# EAGLE schematic jnode_v32 (EAGLE 6.5.0)
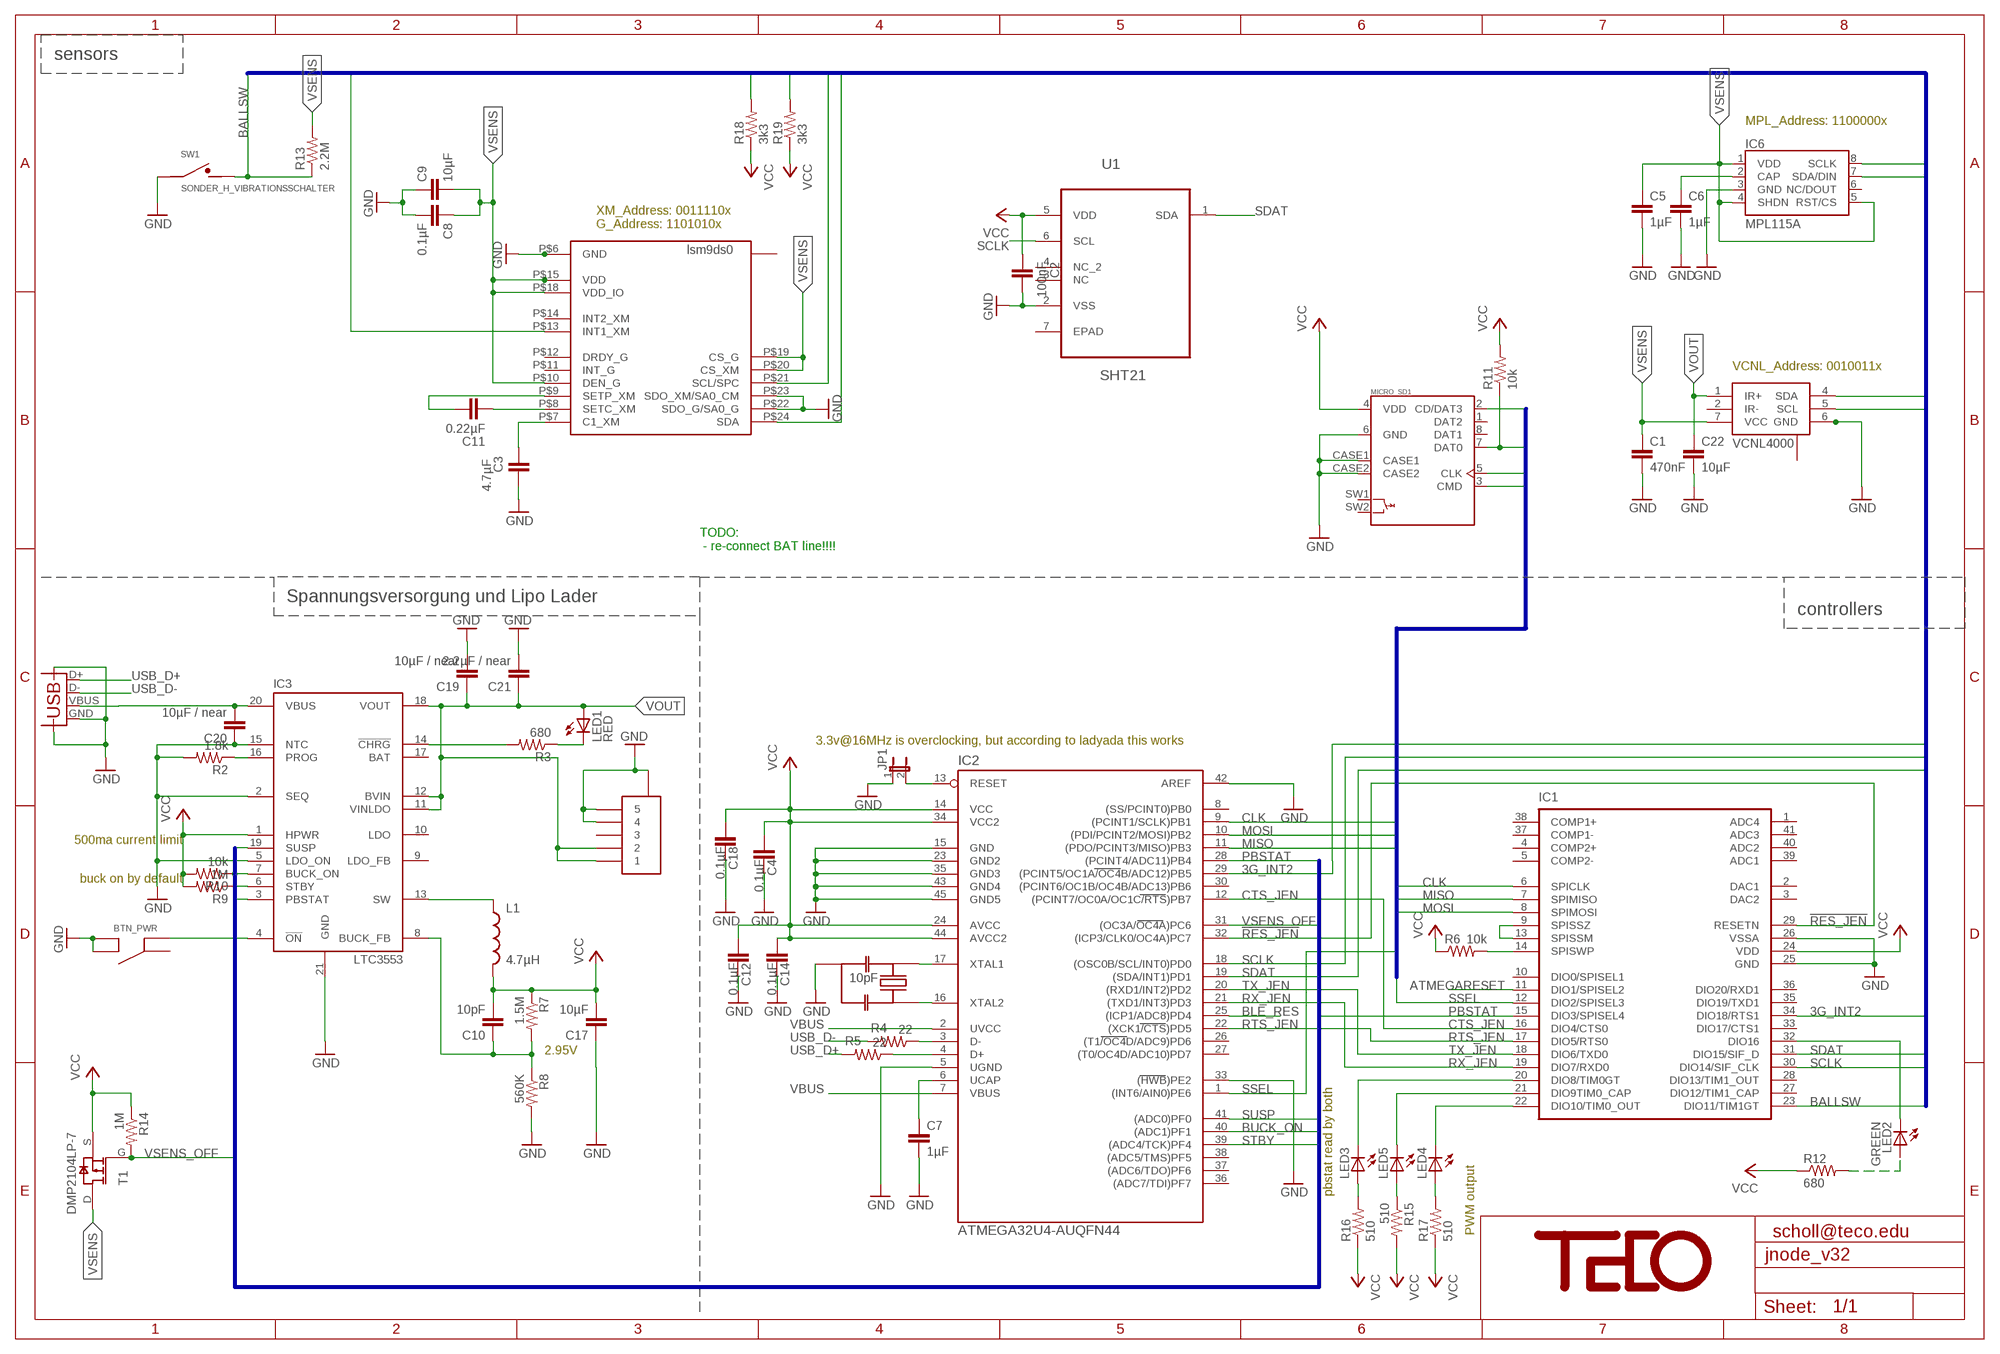
[diagram p0: schematic, sheet 1]

## Parts
BTN_PWR  TACTILE_SWITCH  [EVQ-PUK02K]
C1  470nF  CAP0402-CAP  [0402-CAP]
C2  100nF  CAP0402-CAP  [0402-CAP]
C3  4.7µF  CAP0402-CAP  [0402-CAP]
C4  0.1µF  CAP0402-CAP  [0402-CAP]
C5  1µF  CAP0402-CAP  [0402-CAP]
C6  1µF  CAP0402-CAP  [0402-CAP]
C7  1µF  CAP0402-CAP  [0402-CAP]
C8  0.1µF  CAP0402-CAP  [0402-CAP]
C9  10µF  CAP0603-CAP  [0603-CAP]
C10  10pF  CAP0402-CAP  [0402-CAP]
C11  0.22µF  CAP0402-CAP  [0402-CAP]
C12  0.1µF  CAP0402-CAP  [0402-CAP]
C14  0.1µF  CAP0402-CAP  [0402-CAP]
C17  10µF  CAP0603-CAP  [0603-CAP]
C18  0.1µF  CAP0402-CAP  [0402-CAP]
C19  10µF / near  CAP0603-CAP  [0603-CAP]
C20  10µF / near  CAP0603-CAP  [0603-CAP]
C21  2.2µF / near  CAP0402-CAP  [0402-CAP]
C22  10µF  CAP0603-CAP  [0603-CAP]
IC1  JENNIC_JN51XXSMDTH  [JN5148_SMDTH]
IC2  ATMEGA32U4-AUQFN44  [QFN44]
IC3  LTC3553  [QFN20]
IC6  MPL115A  [LGA8]
JP1  JUMPER-2SMD-NO  [SJ_2S-NO]
L1  4.7µH  SPARKFUN_INDUCTOR  [MLP2012]
LED1  RED  LEDCHIP-LED0402  [CHIP-LED0402]
LED2  GREEN  LEDCHIP-LED0402  [CHIP-LED0402]
LED3  LEDGL100MD1MP1  [GL100MD1MP1]
LED4  LEDGL100MD1MP1  [GL100MD1MP1]
LED5  LEDGL100MD1MP1  [GL100MD1MP1]
MICRO_SD1  SENSOR_BOARD_MOLEX_47309-2651'NEW'  [SENSOR_BOARD_MOLEX_47309-2651]
R2  1.8k  RESISTOR0402-RES  [0402-RES]
R3  680  RESISTOR0402-RES  [0402-RES]
R4  22  RESISTOR0402-RES  [0402-RES]
R5  22  RESISTOR0402-RES  [0402-RES]
R6  10k  RESISTOR0402-RES  [0402-RES]
R7  1.5M  RESISTOR0402-RES  [0402-RES]
R8  560K  RESISTOR0402-RES  [0402-RES]
R9  1M  RESISTOR0402-RES  [0402-RES]
R10  10k  RESISTOR0402-RES  [0402-RES]
R11  10k  RESISTOR0402-RES  [0402-RES]
R12  680  RESISTOR0402-RES  [0402-RES]
R13  2.2M  RESISTOR0402-RES  [0402-RES]
R14  1M  RESISTOR0402-RES  [0402-RES]
R15  510  RESISTOR0402-RES  [0402-RES]
R16  510  RESISTOR0402-RES  [0402-RES]
R17  510  RESISTOR0402-RES  [0402-RES]
R18  3k3  RESISTOR0402-RES  [0402-RES]
R19  3k3  RESISTOR0402-RES  [0402-RES]
SW1  SONDER_H_VIBRATIONSSCHALTER  [SONDER_H_VIBSCHALTER]
T1  DMP2104LP-7  [DFN1411-3]
U1  SHT21  [DFN300X300X110-7N]
U$1  SFV5R  [SFV5R]
U$2  LSM9D  [LGA4X4]
U$6  RESONATORPRQC-S  [PRQC]
U$9  TECO-LOGO  [TECO-LOGO]
VCNL4000  VCNL4000  [VNCL4000]
X1  USBMICROB-XT  [USB-MICROB-XT]

## Nets
3G_INT2: IC1.34(DIO18/RTS1) IC2.29((PCINT5/OC1A/OC4B/ADC12)PB5) U$2.P$13(INT1_XM)
!RES_JEN: IC1.29(RESETN) IC2.32((ICP3/CLK0/OC4A)PC7)
ATMEGARESET: IC1.11(DIO1/SPISEL2) IC2.13(RESET) JP1.2
BALLSW: IC1.23(DIO11/TIM1GT) R13.1 SW1.2
BLE_RES: IC2.25((ICP1/ADC8)PD4)
BUCK_FB: C10.1 IC3.8(BUCK_FB) R7.2 R8.1
BUCK_ON: IC2.40((ADC1)PF1) IC3.7(BUCK_ON) R10.1
CLK: IC1.6(SPICLK) IC2.9((PCINT1/SCLK)PB1) MICRO_SD1.5(CLK)
CTS_JEN: IC1.16(DIO4/CTS0) IC2.12((PCINT7/OC0A/OC1C/RTS)PB7)
GND: BTN_PWR.2(B) BTN_PWR.4(B) C1.2 C2.1 C3.2 C4.1 C5.2 C6.2 C7.2 C8.2 C9.1 C12.1 C14.1 C17.1 C18.1 C19.2 C20.1 C21.2 C22.2 IC1.25(GND) IC1.26(VSSA) IC2.5(UGND) IC2.15(GND) IC2.23(GND2) IC2.33((HWB)PE2) IC2.35(GND3) IC2.42(AREF) IC2.43(GND4) IC2.45(GND5) IC3.2(SEQ) IC3.5(LDO_ON) IC3.15(NTC) IC3.21(GND) IC6.3(GND) JP1.1 MICRO_SD1.6(GND) MICRO_SD1.CASE1 MICRO_SD1.CASE2 R2.2 R8.2 SW1.1 U1.2(VSS) U$1.P$4 U$1.P$5 U$1.P$6 U$1.P$7 U$2.P$5(GND) U$2.P$6(GND) U$2.P$22(SDO_G/SA0_G) U$2.P$23(SDO_XM/SA0_CM) U$6.GND VCNL4000.6(GND) VCNL4000.12(GND) X1.GND X1.GND@2(CASE) X1.GND@3(CASE)
LEDRED: IC1.32(DIO16) LED2.P$2(C)
MISO: IC1.7(SPIMISO) IC2.11((PDO/PCINT3/MISO)PB3) MICRO_SD1.7(DAT0) R11.1
MOSI: IC1.8(SPIMOSI) IC2.10((PDI/PCINT2/MOSI)PB2) MICRO_SD1.3(CMD)
N$1: IC2.3(D-) R4.1
N$2: C3.1 U$2.P$7(C1_XM)
N$3: IC2.4(D+) R5.1
N$4: C7.1 IC2.6(UCAP)
N$5: IC3.16(PROG) R2.1
N$6: VCNL4000.2(IR-) VCNL4000.3(IR-)
N$7: C11.2 U$2.P$8(SETC_XM)
N$8: C11.1 U$2.P$9(SETP_XM)
N$9: BTN_PWR.3(A) IC3.4(!ON)
N$10: C6.1 IC6.2(CAP)
N$11: LED1.P$2(C) R3.1
N$12: IC3.14(!CHRG) R3.2
N$13: IC1.9(SPISSZ) IC1.13(SPISSM)
N$14: IC1.14(SPISWP) R6.2
N$16: IC2.17(XTAL1) U$6.2
N$17: IC2.16(XTAL2) U$6.1
N$29: LED2.P$1(A) R12.2
N$30: IC1.21(DIO9TIM0_CAP) LED5.2(C)
N$31: IC1.20(DIO8/TIM0GT) LED3.2(C)
N$32: LED3.1(A) R16.2
N$33: LED5.1(A) R15.1
N$34: IC1.22(DIO10/TIM0_OUT) LED4.2(C)
N$35: LED4.1(A) R17.2
PBSTAT: IC1.15(DIO3/SPISEL4) IC2.28((PCINT4/ADC11)PB4) IC3.3(PBSTAT)
RTS_JEN: IC1.17(DIO5/RTS0) IC2.22((XCK1/CTS)PD5)
RX_JEN: IC1.19(DIO7/RXD0) IC2.21((TXD1/INT3)PD3)
SCLK: IC1.30(DIO14/SIF_CLK) IC2.18((OSC0B/SCL/INT0)PD0) IC6.8(SCLK) R19.2 U1.6(SCL) U$2.P$21(SCL/SPC) VCNL4000.5(SCL)
SDAT: IC1.31(DIO15/SIF_D) IC2.19((SDA/INT1)PD1) IC6.7(SDA/DIN) R18.2 U1.1(SDA) U$2.P$24(SDA) VCNL4000.4(SDA)
SSEL: IC1.12(DIO2/SPISEL3) IC2.1((INT6/AIN0)PE6) MICRO_SD1.2(CD/DAT3)
STBY: IC2.39((ADC4/TCK)PF4) IC3.6(STBY) R9.1
SUSP: IC2.41((ADC0)PF0) IC3.19(SUSP)
SW: IC3.13(SW) L1.P$1
TX_JEN: IC1.18(DIO6/TXD0) IC2.20((RXD1/INT2)PD2)
USB_D+: R5.2 X1.D+
USB_D-: R4.2 X1.D-
VBUS: C20.2 IC2.2(UVCC) IC2.7(VBUS) IC3.20(VBUS) X1.VBUS
VCC: C2.2 C4.2 C10.2 C12.2 C14.2 C17.2 C18.2 IC1.24(VDD) IC2.14(VCC) IC2.24(AVCC) IC2.34(VCC2) IC2.44(AVCC2) IC3.1(HPWR) L1.P$2 MICRO_SD1.4(VDD) R6.1 R7.1 R9.2 R10.2 R11.2 R12.1 R14.1 R15.2 R16.1 R17.1 R18.1 R19.1 T1.S U1.5(VDD)
VOUT: C19.1 C21.1 C22.1 IC3.11(VINLDO) IC3.12(BVIN) IC3.18(VOUT) LED1.P$1(A) U$1.P$1 U$1.P$2 VCNL4000.1(IR+)
VSENS: C1.1 C5.1 C8.1 C9.2 IC6.1(VDD) IC6.4(SHDN) IC6.5(RST/CS) R13.2 T1.D U$2.P$10(DEN_G) U$2.P$15(VDD) U$2.P$16(VDD) U$2.P$17(VDD) U$2.P$18(VDD_IO) U$2.P$19(CS_G) U$2.P$20(CS_XM) VCNL4000.7(VCC)
VSENS_OFF: IC2.31((OC3A/OC4A)PC6) R14.2 T1.G
Unconnected: BTN_PWR.1(A) IC1.1(ADC4) IC1.2(DAC1) IC1.3(DAC2) IC1.4(COMP2+) IC1.5(COMP2-) IC1.10(DIO0/SPISEL1) IC1.27(DIO12/TIM1_CAP) IC1.28(DIO13/TIM1_OUT) IC1.33(DIO17/CTS1) IC1.35(DIO19/TXD1) IC1.36(DIO20/RXD1) IC1.37(COMP1-) IC1.38(COMP1+) IC1.39(ADC1) IC1.40(ADC2) IC1.41(ADC3) IC2.8((SS/PCINT0)PB0) IC2.26((T1/OC4D/ADC9)PD6) IC2.27((T0/OC4D/ADC10)PD7) IC2.30((PCINT6/OC1B/OC4B/ADC13)PB6) IC2.36((ADC7/TDI)PF7) IC2.37((ADC6/TDO)PF6) IC2.38((ADC5/TMS)PF5) IC3.9(LDO_FB) IC3.10(LDO) IC3.17(BAT) IC6.6(NC/DOUT) MICRO_SD1.1(DAT2) MICRO_SD1.8(DAT1) MICRO_SD1.SW1 MICRO_SD1.SW2 U1.3(NC) U1.4(NC_2) U1.7(EPAD) U$1.P$3 U$2.P$1(RES) U$2.P$2(RES) U$2.P$3(RES) U$2.P$4(RES) U$2.P$11(INT_G) U$2.P$12(DRDY_G) U$2.P$14(INT2_XM) VCNL4000.8(NC) VCNL4000.9(NC) VCNL4000.10(NC) VCNL4000.11(NC)

## Buses
PWRCTRL:BUCK_ON,STBY,PBSTAT,SUSP,VSENS_OFF
SPI:SSEL,MISO,MOSI,CLK
I2C:SCLK,SDAT,BALLSW,3G_INT2

## Notes on the sheet
- sensors
- MPL_Address: 1100000x
- XM_Address: 0011110x
  G_Address: 1101010x
- VCNL_Address: 0010011x
- TODO:
   - re-connect BAT line!!!!
- Spannungsversorgung und Lipo Lader
- controllers
- 3.3v@16MHz is overclocking, but according to ladyada this works
- 500ma current limit
- buck on by default
- 10pF
- 2.95V
- pbstat read by both
- PWM output | scholl@teco.edu

## Library data of the parts
BTN_PWR = jnode:TACTILE_SWITCH: collection of tactile switches; DIGIKEY: http://search.digikey.com/scripts/DkSearch/dksus.dll?Detail&name=P10852SCT-ND
C1 = sparkfun:CAP: Capacitor Standard 0603 ceramic capacitor, and 0.1" leaded capacitor.; DIGIKEY: http://www.digikey.com/product-detail/en/JMK105BJ474KV-F/587-1230-1-ND/931007
C2 = sparkfun:CAP: Capacitor Standard 0603 ceramic capacitor, and 0.1" leaded capacitor.; DIGIKEY: http://www.digikey.com/product-detail/en/C1005X5R0J104K050BA/445-1266-1-ND/567731
C3 = sparkfun:CAP: Capacitor Standard 0603 ceramic capacitor, and 0.1" leaded capacitor.; DIGIKEY: http://www.digikey.com/product-detail/en/CL05A475MQ5NRNC/1276-1056-1-ND/3889142
C4 C18 = sparkfun:CAP: Capacitor Standard 0603 ceramic capacitor, and 0.1" leaded capacitor.; DIGIKEY: http://search.digikey.com/scripts/DkSearch/dksus.dll?Detail&name=490-1318-1-ND; FARNELL: http://de.farnell.com/multicomp/mcca000051/mlcc-04025v-16v-100nf/dp/1758897; PLACE: no; TECO: yes
C5 C6 = sparkfun:CAP: Capacitor Standard 0603 ceramic capacitor, and 0.1" leaded capacitor.; DIGIKEY: http://search.digikey.com/scripts/DkSearch/dksus.dll?Detail&name=490-1320-1-ND; FARNELL: http://de.farnell.com/multicomp/mcca000500/mlcc-0402-x5r-6-3v-1uf/dp/1759375
C7 = sparkfun:CAP: Capacitor Standard 0603 ceramic capacitor, and 0.1" leaded capacitor.; DIGIKEY: http://search.digikey.com/scripts/DkSearch/dksus.dll?Detail&name=490-1320-1-ND; FARNELL: http://de.farnell.com/multicomp/mcca000500/mlcc-0402-x5r-6-3v-1uf/dp/1759375; TECO: yes
C8 C12 C14 = sparkfun:CAP: Capacitor Standard 0603 ceramic capacitor, and 0.1" leaded capacitor.; DIGIKEY: http://search.digikey.com/scripts/DkSearch/dksus.dll?Detail&name=490-1318-1-ND; FARNELL: http://de.farnell.com/multicomp/mcca000051/mlcc-04025v-16v-100nf/dp/1758897; TECO: yes
C9 = sparkfun:CAP: Capacitor Standard 0603 ceramic capacitor, and 0.1" leaded capacitor.; DIGIKEY: http://search.digikey.com/scripts/DkSearch/dksus.dll?Detail&name=445-7454-1-ND
C10 = sparkfun:CAP: Capacitor Standard 0603 ceramic capacitor, and 0.1" leaded capacitor.; DIGIKEY: http://search.digikey.com/scripts/DkSearch/dksus.dll?Detail&name=311-1014-1-ND; FARNELL: http://de.farnell.com/multicomp/mcca000091/mlcc-0402-np0-50v-10pf/dp/1758941; TECO: yes
C11 = sparkfun:CAP: Capacitor Standard 0603 ceramic capacitor, and 0.1" leaded capacitor.; DIGIKEY: http://www.digikey.com/product-detail/en/C0402C224K9PACTU/399-4886-1-ND/1090881
C17 C22 = sparkfun:CAP: Capacitor Standard 0603 ceramic capacitor, and 0.1" leaded capacitor.; DIGIKEY: http://www.digikey.com/product-detail/en/C1608X6S0G106K080AB/445-7454-1-ND/2733526
C19 C20 = sparkfun:CAP: Capacitor Standard 0603 ceramic capacitor, and 0.1" leaded capacitor.; DIGIKEY: http://search.digikey.com/scripts/DkSearch/dksus.dll?Detail&name=445-7454-1-ND; FARNELL: http://de.farnell.com/multicomp/mcca000517/mlcc-0603-x5r-6-3v-10uf/dp/1759393; TECO: yes
C21 = sparkfun:CAP: Capacitor Standard 0603 ceramic capacitor, and 0.1" leaded capacitor.; DIGIKEY: http://search.digikey.com/scripts/DkSearch/dksus.dll?Detail&name=445-7396-1-ND; FARNELL: http://de.farnell.com/multicomp/mcca000501/mlcc-0402-x5r-6-3v-2-2uf/dp/1759376RL; TECO: yes
IC1 = jnode:JENNIC_JN51XX: JN5139-xxx-M00xxx, Farnell: 1500175; DIGIKEY: http://search.digikey.com/de/de/products/JN5148%2F001M00T,534/616-1045-1-ND/2139684; FUTUREELECTRIC: http://de.futureelectronics.com/de/technologies/semiconductors/microcontrollers/32-bit/Seiten/6004977-JN5148-001M00T,534.aspx; PLACE: NO; TECO: yes
IC2 = jnode:ATMEGA32U4-AU; DIGIKEY: http://search.digikey.com/scripts/DkSearch/dksus.dll?Detail&name=ATMEGA32U4-MU-ND
IC3 = jnode:LTC3553; DIGIKEY: http://search.digikey.com/scripts/DkSearch/dksus.dll?Detail&name=LTC3553EUD%23PBF-ND
IC6 = mpl115:MPL115A: MPL115A1 (SPI) and MPL115A2 (I2C) Miniature Digital Barometer 5.0x3.0x1.2mm LGA Package; DIGIKEY: http://search.digikey.com/scripts/DkSearch/dksus.dll?Detail&name=MPL115A2T1CT-ND; TECO: yes
JP1 = sparkfun:JUMPER-2: Jumper Basic 0.1" spaced jumper. Use with breakaway headers.
L1 = jnode:SPARKFUN_INDUCTOR: Inductors Basic Inductor/Choke - 0603 and 1206. Footprints are not proven and vary greatly between part numbers.; DIGIKEY: http://search.digikey.com/scripts/DkSearch/dksus.dll?Detail&name=445-6366-1-ND; FARNELL: http://de.farnell.com/tdk/mlp2012s4r7mt/vielschicht-induktivitaet-4-7uh/dp/2345132?Ntt=MLP2012S4R7M
LED1 LED2 = jnode:LED: LED OSRAM: - CHIPLED LG R971, LG N971, LY N971, LG Q971, LY Q971, LO R971, LY R971 LH N974, LH R974 LS Q976, LO Q976, LY Q976 LO Q996 - Hyper CHIPLED LW Q18S LB Q993, LB Q99A, LB R99A - SideLED LS A670, LO A670, LY A670, LG A670, LP A670 LB A673, LV A673, LT A673, LW A673 LH A674 LY A675 LS A676, LA A676, LO A676, LY A676, LW A676 LS A679, LY A679, LG A679 - Hyper Micro SIDELED� LS Y876, LA Y876, LO Y876, LY Y876 LT Y87S - SmartLED LW L88C, LW L88S LB L89C, LB L89S, LG L890 LS L89K, LO L89K, LY L89K LS L896, LA L896, LO L896, LY L896 - TOPLED LS T670, LO T670, LY T670, LG T670, LP T670 LSG T670, LSP T670, LSY T670, LOP T670, LYG T670 LG T671, LOG T671, LSG T671 LB T673, LV T673, LT T673, LW T673 LH T674 LS T676, LA T676, LO T676, LY T676, LB T676, LH T676, LSB T676, LW T676 LB T67C, LV T67C, LT T67C, LS T67K, LO T67K, LY T67K, LW E67C LS E67B, LA E67B, LO E67B, LY E67B, LB E67C, LV E67C, LT E67C LW T67C LS T679, LY T679, LG T679 LS T770, LO T770, LY T770, LG T770, LP T770 LB T773, LV T773, LT T773, LW T773 LH T774 LS E675, LA E675, LY E675, LS T675 LS T776, LA T776, LO T776, LY T776, LB T776 LHGB T686 LT T68C, LB T68C - Hyper Mini TOPLED� LB M676 - Mini TOPLED Santana� LG M470 LS M47K, LO M47K, LY M47K Source: http://www.osram.convergy.de LUXEON: - LUMILED� LXK2-PW12-R00, LXK2-PW12-S00, LXK2-PW14-U00, LXK2-PW14-V00 LXK2-PM12-R00, LXK2-PM12-S00, LXK2-PM14-U00 LXK2-PE12-Q00, LXK2-PE12-R00, LXK2-PE12-S00, LXK2-PE14-T00, LXK2-PE14-U00 LXK2-PB12-K00, LXK2-PB12-L00, LXK2-PB12-M00, LXK2-PB14-N00, LXK2-PB14-P00, LXK2-PB14-Q00 LXK2-PR12-L00, LXK2-PR12-M00, LXK2-PR14-Q00, LXK2-PR14-R00 LXK2-PD12-Q00, LXK2-PD12-R00, LXK2-PD12-S00 LXK2-PH12-R00, LXK2-PH12-S00 LXK2-PL12-P00, LXK2-PL12-Q00, LXK2-PL12-R00 Source: www.luxeon.com KINGBRIGHT: KA-3528ASYC Source: www.kingbright.com; DIGIKEY: http://search.digikey.com/scripts/DkSearch/dksus.dll?Detail&name=754-1128-1-ND; TECO: yes
LED3-LED5 = jnode:LED: LED OSRAM: - CHIPLED LG R971, LG N971, LY N971, LG Q971, LY Q971, LO R971, LY R971 LH N974, LH R974 LS Q976, LO Q976, LY Q976 LO Q996 - Hyper CHIPLED LW Q18S LB Q993, LB Q99A, LB R99A - SideLED LS A670, LO A670, LY A670, LG A670, LP A670 LB A673, LV A673, LT A673, LW A673 LH A674 LY A675 LS A676, LA A676, LO A676, LY A676, LW A676 LS A679, LY A679, LG A679 - Hyper Micro SIDELED� LS Y876, LA Y876, LO Y876, LY Y876 LT Y87S - SmartLED LW L88C, LW L88S LB L89C, LB L89S, LG L890 LS L89K, LO L89K, LY L89K LS L896, LA L896, LO L896, LY L896 - TOPLED LS T670, LO T670, LY T670, LG T670, LP T670 LSG T670, LSP T670, LSY T670, LOP T670, LYG T670 LG T671, LOG T671, LSG T671 LB T673, LV T673, LT T673, LW T673 LH T674 LS T676, LA T676, LO T676, LY T676, LB T676, LH T676, LSB T676, LW T676 LB T67C, LV T67C, LT T67C, LS T67K, LO T67K, LY T67K, LW E67C LS E67B, LA E67B, LO E67B, LY E67B, LB E67C, LV E67C, LT E67C LW T67C LS T679, LY T679, LG T679 LS T770, LO T770, LY T770, LG T770, LP T770 LB T773, LV T773, LT T773, LW T773 LH T774 LS E675, LA E675, LY E675, LS T675 LS T776, LA T776, LO T776, LY T776, LB T776 LHGB T686 LT T68C, LB T68C - Hyper Mini TOPLED� LB M676 - Mini TOPLED Santana� LG M470 LS M47K, LO M47K, LY M47K Source: http://www.osram.convergy.de LUXEON: - LUMILED� LXK2-PW12-R00, LXK2-PW12-S00, LXK2-PW14-U00, LXK2-PW14-V00 LXK2-PM12-R00, LXK2-PM12-S00, LXK2-PM14-U00 LXK2-PE12-Q00, LXK2-PE12-R00, LXK2-PE12-S00, LXK2-PE14-T00, LXK2-PE14-U00 LXK2-PB12-K00, LXK2-PB12-L00, LXK2-PB12-M00, LXK2-PB14-N00, LXK2-PB14-P00, LXK2-PB14-Q00 LXK2-PR12-L00, LXK2-PR12-M00, LXK2-PR14-Q00, LXK2-PR14-R00 LXK2-PD12-Q00, LXK2-PD12-R00, LXK2-PD12-S00 LXK2-PH12-R00, LXK2-PH12-S00 LXK2-PL12-P00, LXK2-PL12-Q00, LXK2-PL12-R00 Source: www.luxeon.com KINGBRIGHT: KA-3528ASYC Source: www.kingbright.com; FARNELL: http://de.farnell.com/sharp/gl100md1mp1/ir-emitter-smd-940nm/dp/9707816?Ntt=970-7816; PLACE: no
MICRO_SD1 = teco_div:SENSOR_BOARD_MOLEX_47309-2651; DIGIKEY: http://search.digikey.com/scripts/DkSearch/dksus.dll?Detail&name=WM3974CT-ND; TECO: yes
R2 = sparkfun:RESISTOR: Resistor Basic schematic elements and footprints for 0603, 1206, and PTH 1/10th watt (small) resistors.; DIGIKEY: http://search.digikey.com/scripts/DkSearch/dksus.dll?Detail&name=311-1.8KJRCT-ND; FARNELL: http://de.farnell.com/vishay-draloric/crcw04021k80fkeahp/widerstand-0402-1-1k80/dp/1738853; TECO: yes
R3 = sparkfun:RESISTOR: Resistor Basic schematic elements and footprints for 0603, 1206, and PTH 1/10th watt (small) resistors.; DIGIKEY: http://www.digikey.com/product-search/en?FV=fff40001%2Cfff800e9%2C40294%2C142c07b9%2C142c1639&mnonly=0&newproducts=0&ColumnSort=0&page=1&stock=1&pbfree=0&rohs=0&quantity=70&ptm=0&fid=0&pageSize=25
R4 R5 = sparkfun:RESISTOR: Resistor Basic schematic elements and footprints for 0603, 1206, and PTH 1/10th watt (small) resistors.; DIGIKEY: http://search.digikey.com/scripts/DkSearch/dksus.dll?Detail&name=311-22JRCT-ND; FARNELL: http://de.farnell.com/multicomp/mc-0-0625w-0402-1-22r/widerstand-0402-1-22r/dp/1357998
R6 = sparkfun:RESISTOR: Resistor Basic schematic elements and footprints for 0603, 1206, and PTH 1/10th watt (small) resistors.; DIGIKEY: http://search.digikey.com/scripts/DkSearch/dksus.dll?Detail&name=311-10KJRCT-ND; FARNELL: http://de.farnell.com/bourns/cr0603-jw-103elf/widerstand-0603-10k-5-0-1w/dp/2008360; TECO: yes
R7 = sparkfun:RESISTOR: Resistor Basic schematic elements and footprints for 0603, 1206, and PTH 1/10th watt (small) resistors.; DIGIKEY: http://www.digikey.com/product-detail/en/RC0402JR-071M5L/311-1.5MJRCT-ND/729360
R8 = sparkfun:RESISTOR: Resistor Basic schematic elements and footprints for 0603, 1206, and PTH 1/10th watt (small) resistors.; DIGIKEY: http://www.digikey.com/product-detail/en/RC0402FR-07560KL/311-560KLRCT-ND/729584
R9 = sparkfun:RESISTOR: Resistor Basic schematic elements and footprints for 0603, 1206, and PTH 1/10th watt (small) resistors.; DIGIKEY: http://www.digikey.com/product-detail/en/RC0402FR-071ML/311-1.00MLRCT-ND/729462
R10 R11 = sparkfun:RESISTOR: Resistor Basic schematic elements and footprints for 0603, 1206, and PTH 1/10th watt (small) resistors.; DIGIKEY: http://search.digikey.com/scripts/DkSearch/dksus.dll?Detail&name=311-10KJRCT-ND
R12 = sparkfun:RESISTOR: Resistor Basic schematic elements and footprints for 0603, 1206, and PTH 1/10th watt (small) resistors.; DIGIKEY: http://www.digikey.com/product-detail/en/MCR01MRTF6800/RHM680CDCT-ND/2796437
R13 = sparkfun:RESISTOR: Resistor Basic schematic elements and footprints for 0603, 1206, and PTH 1/10th watt (small) resistors.; DIGIKEY: http://search.digikey.com/scripts/DkSearch/dksus.dll?Detail&name=541-2.20MLCT-ND; FARNELL: http://de.farnell.com/te-connectivity-cgs/rh73u2a2m2jtd/widerstand-0805-2m2/dp/1174056
R14 = sparkfun:RESISTOR: Resistor Basic schematic elements and footprints for 0603, 1206, and PTH 1/10th watt (small) resistors.; DIGIKEY: http://www.digikey.com/product-detail/en/RC0402FR-071ML/311-1.00MLRCT-ND/729462; PLACE: no
R15-R17 = sparkfun:RESISTOR: Resistor Basic schematic elements and footprints for 0603, 1206, and PTH 1/10th watt (small) resistors.; PLACE: no
R18 R19 = sparkfun:RESISTOR: Resistor Basic schematic elements and footprints for 0603, 1206, and PTH 1/10th watt (small) resistors.; DIGIKEY: http://search.digikey.com/scripts/DkSearch/dksus.dll?Detail&name=541-2.20MLCT-ND; FARNELL: http://de.farnell.com/bourns/cr0603-jw-103elf/widerstand-0603-10k-5-0-1w/dp/2008360
SW1 = jnode:SONDER_H_VIBRATIONSSCHALTER: Vibrationsschalter von FZK oder Signalquest SignalQuest, Inc. 1 Mechanic St. Lebanon, NH 03766 USA www.signalquest.com; PLACE: NO
T1 = jnode:DMP2104LP
U1 = zittel:SHT21: SENSOR, HUMIDITY & TEMP; FARNELL: http://de.farnell.com/sensirion/sht21/sensor-feuchte-temp-3x3mm-2/dp/1855468?Ntt=1855468; MPN: SHT21; OC_FARNELL: 1855468; OC_NEWARK: 20T1172; PACKAGE: DFN-6; SUPPLIER: SENSIRION
U$1 = jnode:SFV5R; DIGIKEY: http://www.digikey.com/product-detail/en/SFV5R-2STE1HLF/609-4331-1-ND/2626782
U$2 = jnode:LSM9D; DIGIKEY: http://www.digikey.de/product-detail/de/LSM9DS0TR/497-13902-1-ND/4311634
U$6 = jnode:RESONATOR: Ceramic Resonator with caps AWSCR-16.00CV-T: 16Mhz ceramic resonator with 22pF capacitors PRQC16.00SR5010X000: 16Mhz ceramic resonator with 10pF capacitors; DIGIKEY: http://search.digikey.com/scripts/DkSearch/dksus.dll?Detail&name=478-5420-1-ND
U$9 = teco_div:TECO-LOGO; PLACE: no
VCNL4000 = VCNL4000:VCNL4000; DIGIKEY: http://www.digikey.com/product-detail/en/VCNL4010-GS08/VCNL4010-GS08TR-ND/2796065
X1 = sparkfun:USB: USB Connectors USB-B-PTH is fully proven SKU : PRT-00139 USB-miniB is fully proven SKU : PRT-00587 USB-A-PCB is untested. USB-A-H is throughly reviewed, but untested. Spark Fun Electronics SKU : PRT-00437 USB-B-SMT is throughly reviewed, but untested. Needs silkscreen touching up. USB-A-S has not been used/tested USB-MB-H has not been used/tested; DIGIKEY: http://search.digikey.com/scripts/DkSearch/dksus.dll?Detail&name=H11635CT-ND